# Altium schematic sheet machNguyenLy.SchDoc
size A4
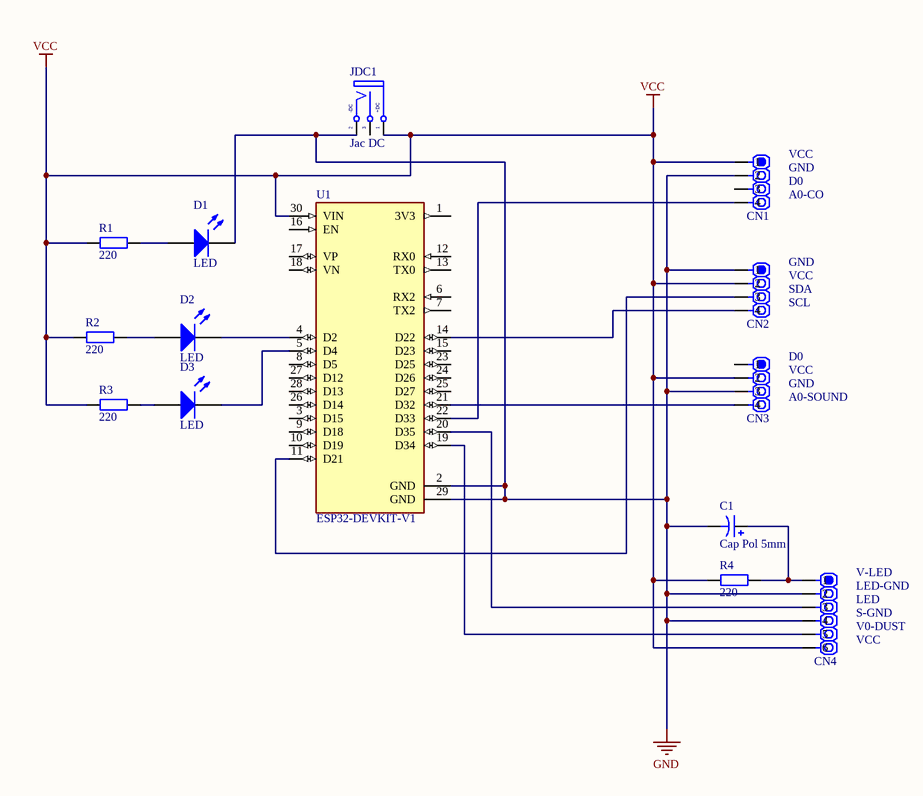
[diagram p0: machNguyenLy.SchDoc]

## Parts
C1  Cap Pol 5mm  [C5mm]
CN1  IO  [CON.HDR1X4]  (value not drawn)
CN2  IO  [CON.HDR1X4]  (value not drawn)
CN3  IO  [CON.HDR1X4]  (value not drawn)
CN4  IO  [CON.HDR1X6]  (value not drawn)
D1  LED  [LED-0 5mm RED]
D2  LED  [LED-0 5mm RED]
D3  LED  [LED-0 5mm RED]
JDC1  Jac DC  [DC-IN]
R1  220  [R1/4W]
R2  220  [R1/4W]
R3  220  [R1/4W]
R4  220  [R1/4W]
U1  ESP32-DEVKIT-V1  [MODULE_ESP32_DEVKIT_V1]

## Nets
GND: C1.2 CN1.2 CN2.1 CN3.3 CN4.2 CN4.4 D1.2(K) JDC1.2(TN) U1.2(GND) U1.29(GND)
VCC: CN1.1 CN2.2 CN3.2 CN4.6 JDC1.1(T) R1.1 R2.1 R3.1 R4.1 U1.30(VIN)
NetC1_1: C1.1 CN4.1 R4.2
NetCN1_4: CN1.4 U1.22(D33)
NetCN2_3: CN2.3 U1.11(D21)
NetCN2_4: CN2.4 U1.14(D22)
NetCN3_4: CN3.4 U1.21(D32)
NetCN4_3: CN4.3 U1.20(D35)
NetCN4_5: CN4.5 U1.19(D34)
NetD1_1: D1.1(A) R1.2
NetD2_1: D2.1(A) R2.2
NetD2_2: D2.2(K) U1.4(D2)
NetD3_1: D3.1(A) R3.2
NetD3_2: D3.2(K) U1.5(D4)

Not connected (* = marked no-connect by the designer): CN1 3; CN3 1; JDC1 3(S); U1 1(3V3) 3(D15) 6(RX2) 7(TX2) 8(D5) 9(D18) 10(D19) 12(RX0) 13(TX0) 15(D23) 16(EN) 17(VP) 18(VN) 23(D25) 24(D26) 25(D27) 26(D14) 27(D12) 28(D13)

## Notes on the sheet
- (near CN1) VCC
- (near CN1) GND
- (near CN1) D0
- (near CN1) A0-CO
- (near CN2) GND
- (near CN2) VCC
- (near CN2) SDA
- (near CN2) SCL
- D0
- (near CN3) VCC
- (near CN3) GND
- (near CN3) A0-SOUND
- (near CN4) V-LED
- (near CN4) LED-GND
- (near CN4) LED
- (near CN4) S-GND
- (near CN4) V0-DUST
- (near CN4) VCC
- (in symbol DCIN) -DC; +DC

## Library data of the parts
C1 = Cap Pol 5mm: Polarized Capacitor (Axial); Published: 8-Jun-2000; LatestRevisionDate: 17-Jul-2002; LatestRevisionNote: Re-released for DXP Platform.; PackageReference: POLAR0.8; Publisher: Altium Limited
CN1-CN3 = CON.HDR1x4: Header 1x4; Publisher: Hoang Nguyen; ComponentLink1Description: Digikey Part link; ComponentLink2Description: Open DataSheet; ComponentLink2URL: H:\LIBRARY\LIBRARY.Datasheet\
CN4 = CON.HDR1x6: Header 1x6; Publisher: Hoang Nguyen; ComponentLink1Description: Digikey Part link; ComponentLink2Description: Open DataSheet; ComponentLink2URL: H:\LIBRARY\LIBRARY.Datasheet\
D1-D3 = LED: Typical LED; Published: 8-Jun-2000; LatestRevisionDate: 08-Jul-2005; LatestRevisionNote: Mech Layer 1 removed.; PackageReference: LED-1; Publisher: Altium Limited
JDC1 = DCIN: Jac DC input; Value: Jac DC
R1-R4 = R1/4W: Resistor 1/4W; Value: R1/4W - 1K
U1 = ESP32-DEVKIT-V1: Dual core, Wi-Fi: 2.4 GHz up to 150 Mbits/s,BLE (Bluetooth Low Energy) and legacy Bluetooth, 32 bits, Up to 240 MHz; MF: Do it; Value: *; MP: ESP32-DEVKIT-V1; SnapEDA_Link: https://www.snapeda.com/parts/ESP32-DEVKIT-V1/Do+it/view-part/?ref=snap; Price: None; Package: None; Check_prices: https://www.snapeda.com/parts/ESP32-DEVKIT-V1/Do+it/view-part/?ref=eda; Availability: Not in stock